# Altium schematic sheet MAIN.SchDoc
size 381 x 241 mm; SheetNumber: 1; SheetTotal: 7
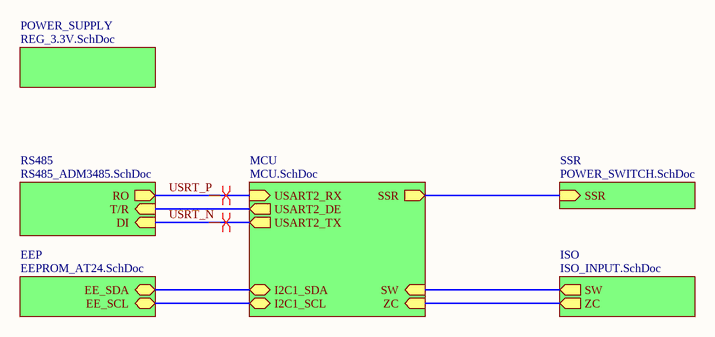
[diagram p0: MAIN.SchDoc]

## Sub-sheets
EEP = EEPROM_AT24.SchDoc: EE_SCL (bidir), EE_SDA (bidir)
ISO = ISO_INPUT.SchDoc: SW (out), ZC (out)
MCU = MCU.SchDoc: SSR (out), ZC (in), SW (in), USART2_DE (out), USART2_RX (in), USART2_TX (out), I2C1_SCL (bidir), I2C1_SDA (bidir)
POWER_SUPPLY = REG_3.3V.SchDoc: no entries
RS485 = RS485_ADM3485.SchDoc: RO (out), T/R (in), DI (in)
SSR = POWER_SWITCH.SchDoc: SSR (in)

## Nets
USRT_N: sheet MCU/USART2_TX, sheet RS485/DI
USRT_P: sheet MCU/USART2_RX, sheet RS485/RO
(unnamed): sheet EEP/EE_SCL, sheet MCU/I2C1_SCL
(unnamed): sheet EEP/EE_SDA, sheet MCU/I2C1_SDA
(unnamed): sheet ISO/SW, sheet MCU/SW
(unnamed): sheet ISO/ZC, sheet MCU/ZC
(unnamed): sheet MCU/SSR, sheet SSR/SSR
(unnamed): sheet MCU/USART2_DE, sheet RS485/T/R

## Layout directives
differential pair: USRT_N, USRT_P